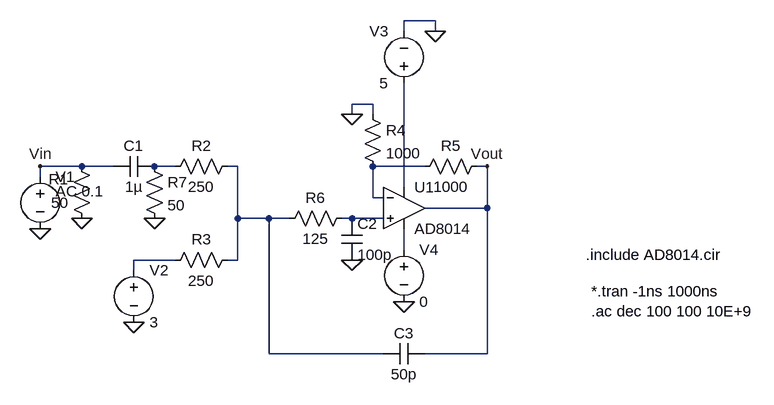
[diagram p0: schematic Digitizer_AFE.asc]
Digitizer_AFE.asc, the LTspice schematic file:
Version 4
SHEET 1 880 680
WIRE -48 0 -96 0
WIRE -96 16 -96 0
WIRE -48 16 -48 0
WIRE -144 128 -176 128
WIRE -176 144 -176 128
WIRE -144 144 -144 128
WIRE -592 224 -656 224
WIRE -544 224 -592 224
WIRE -448 224 -480 224
WIRE -352 224 -368 224
WIRE -64 224 -144 224
WIRE 32 224 16 224
WIRE -656 240 -656 224
WIRE -96 256 -96 96
WIRE -144 272 -144 224
WIRE -128 272 -144 272
WIRE 32 288 32 224
WIRE 32 288 -64 288
WIRE -352 304 -352 224
WIRE -304 304 -352 304
WIRE -272 304 -304 304
WIRE -176 304 -192 304
WIRE -128 304 -176 304
WIRE -96 352 -96 320
WIRE -448 368 -512 368
WIRE -352 368 -352 304
WIRE -352 368 -368 368
WIRE -512 384 -512 368
WIRE -304 512 -304 304
WIRE -128 512 -304 512
WIRE 32 512 32 288
WIRE 32 512 -64 512
FLAG -176 144 0
FLAG -656 224 Vin
FLAG 32 224 Vout
FLAG -48 16 0
FLAG -96 432 0
FLAG -656 320 0
FLAG -512 464 0
FLAG -592 304 0
FLAG -176 368 0
FLAG -480 304 0
SYMBOL opamp2 -96 224 R0
SYMATTR InstName U1
SYMATTR Value AD8014
SYMBOL voltage -656 224 R0
WINDOW 3 24 38 Invisible 2
WINDOW 123 24 38 Left 2
SYMATTR Value EXP(0 0 0 0 0 0)
SYMATTR Value2 AC 0.1
SYMATTR InstName V1
SYMBOL voltage -512 368 R0
SYMATTR InstName V2
SYMATTR Value 3
SYMBOL res -576 320 R180
WINDOW 0 36 76 Left 2
WINDOW 3 36 40 Left 2
SYMATTR InstName R1
SYMATTR Value 50
SYMBOL res -464 240 R270
WINDOW 0 32 56 VTop 2
WINDOW 3 0 56 VBottom 2
SYMATTR InstName R2
SYMATTR Value 250
SYMBOL res -352 352 R90
WINDOW 0 0 56 VBottom 2
WINDOW 3 32 56 VTop 2
SYMATTR InstName R3
SYMATTR Value 250
SYMBOL voltage -96 112 R180
WINDOW 0 24 96 Left 2
WINDOW 3 24 16 Left 2
SYMATTR InstName V3
SYMATTR Value 5
SYMBOL res -160 128 R0
SYMATTR InstName R4
SYMATTR Value 1000
SYMBOL voltage -96 336 R0
SYMATTR InstName V4
SYMATTR Value 0
SYMBOL res 32 208 R90
WINDOW 0 0 56 VBottom 2
WINDOW 3 32 56 VTop 2
SYMATTR InstName R5
SYMATTR Value 1000
SYMBOL res -176 288 R90
WINDOW 0 0 56 VBottom 2
WINDOW 3 32 56 VTop 2
SYMATTR InstName R6
SYMATTR Value 125
SYMBOL cap -192 304 R0
SYMATTR InstName C2
SYMATTR Value 100p
SYMBOL cap -64 496 R90
WINDOW 0 0 32 VBottom 2
WINDOW 3 32 32 VTop 2
SYMATTR InstName C3
SYMATTR Value 50p
SYMBOL cap -480 208 R90
WINDOW 0 0 32 VBottom 2
WINDOW 3 32 32 VTop 2
SYMATTR InstName C1
SYMATTR Value 1µ
SYMBOL res -496 208 R0
SYMATTR InstName R7
SYMATTR Value 50
TEXT 184 360 Left 2 !.include AD8014.cir
TEXT 192 416 Left 2 !*.tran -1ns 1000ns\n.ac dec 100 100 10E+9

The netlist it stands for:
* Digitizer_AFE.asc
XU1 N005 N003 N004 N006 Vout AD8014  ; pins In+ In- V+ V- OUT
V1 Vin 0 EXP(0 0 0 0 0 0) AC 0.1
V2 N007 0 3
R1 0 Vin 50
R2 N001 N002 250
R3 N002 N007 250
V3 N004 0 5
R4 0 N003 1000
V4 N006 0 0
R5 Vout N003 1000
R6 N005 N002 125
C2 N005 0 100p
C3 Vout N002 50p
C1 N001 Vin 1µ
R7 N001 0 50
.include AD8014.cir
*.tran -1ns 1000ns
.ac dec 100 100 10E+9
.backanno
.end